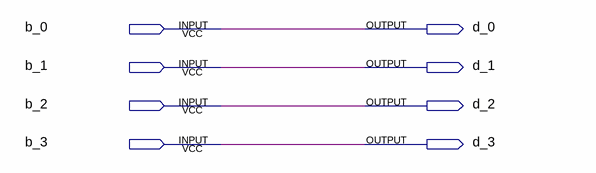
[diagram p0: schematic sheet]
// Quartus schematic Tastenentpreller.bdf as structural Verilog: 0 symbols, 8 pins
module Tastenentpreller (
  input  b_0,
  input  b_1,
  input  b_2,
  input  b_3,
  output d_0,
  output d_1,
  output d_2,
  output d_3
);


  assign d_0 = b_0;
  assign d_1 = b_1;
  assign d_2 = b_2;
  assign d_3 = b_3;
endmodule
